# Altium schematic sheet 7 Inch Module.SchDoc: 7" TFT LCD (part 1 of 3)
size A4; SheetSize: A4
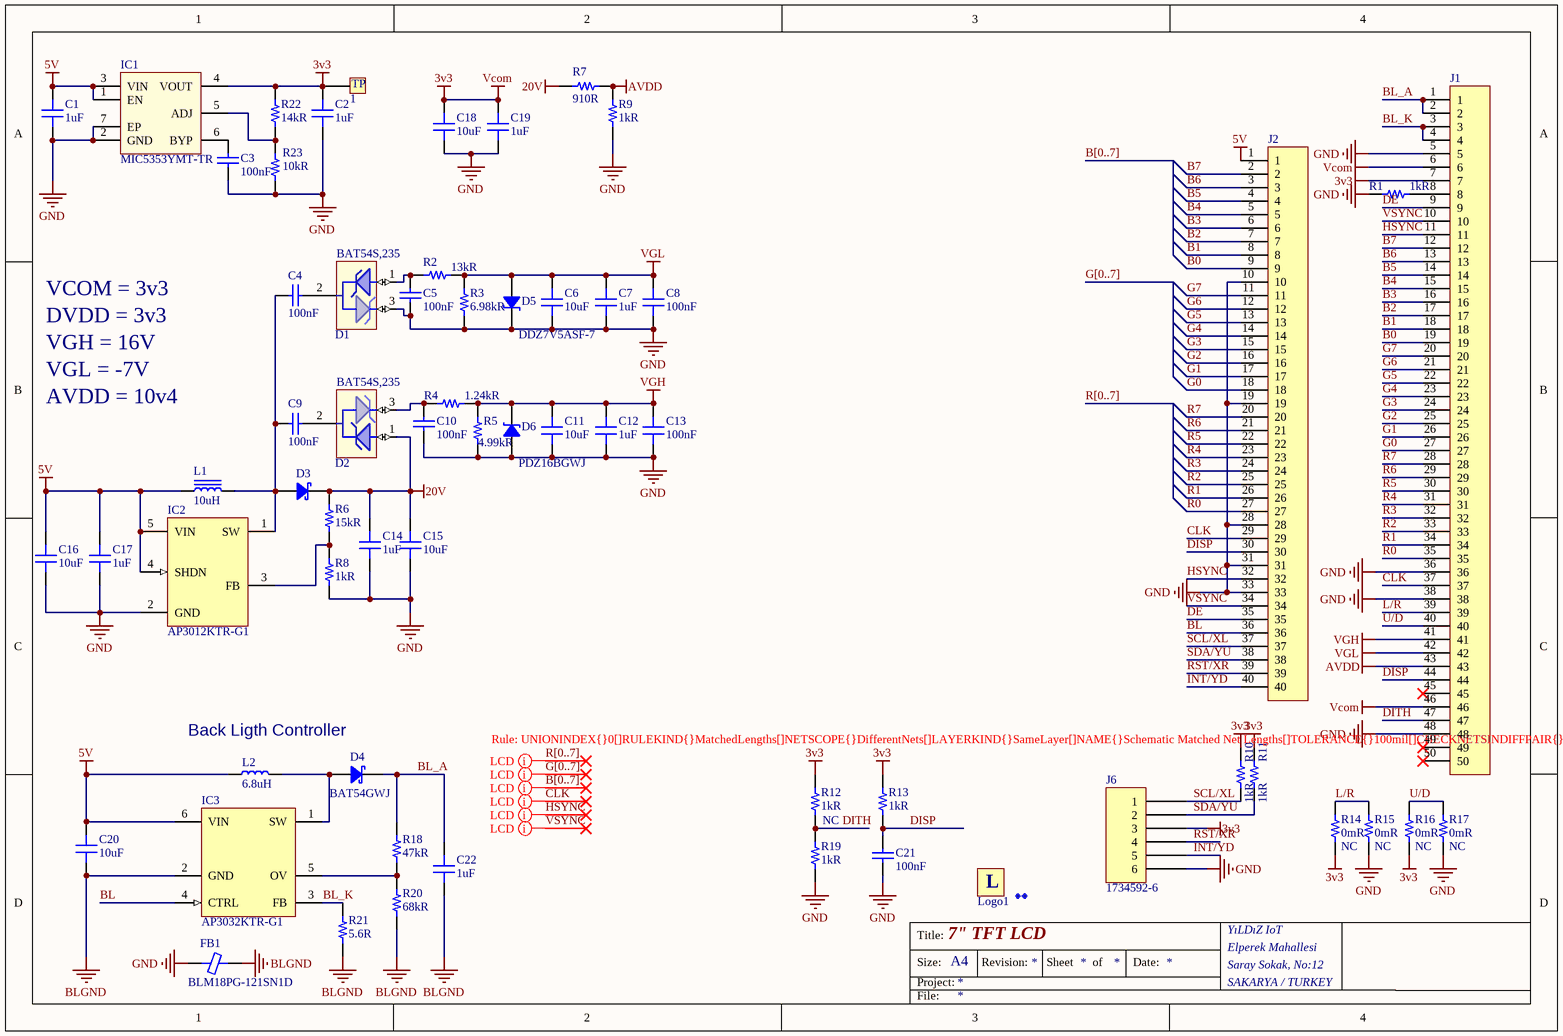
[diagram p0: 7 Inch Module.SchDoc]

## Parts
1  Test Point  [TestPoint]  (value not drawn)  (no BOM)
C1  1uF  [CAP 0603/1608]
C2  1uF  [CAP 0603/1608]
C3  100nF  [CAP 0603/1608]
C4  100nF  [CAP 0603/1608]
C5  100nF  [CAP 0603/1608]
C6  10uF  [CAP 0603/1608]
C7  1uF  [CAP 0603/1608]
C8  100nF  [CAP 0603/1608]
C9  100nF  [CAP 0603/1608]
C10  100nF  [CAP 0603/1608]
C11  10uF  [CAP 0603/1608]
C12  1uF  [CAP 0603/1608]
C13  100nF  [CAP 0603/1608]
C14  1uF  [CAP 0603/1608]
C15  10uF  [CAP 0603/1608]
C16  10uF  [CAP 0603/1608]
C17  1uF  [CAP 0603/1608]
C18  10uF  [CAP 0603/1608]
C19  1uF  [CAP 0603/1608]
C20  10uF  [CAP 0603/1608]
C21  100nF  [CAP 0603/1608]
C22  1uF  [CAP 0603/1608]
D1  BAT54S,235  [DIODES SOT-23-3]
D2  BAT54S,235  [DIODES SOT-23-3]
D3  1N5819HW-7-F  [SOD-123]  (value not drawn)
D4  BAT54GWJ  [SOD-123]
D5  DDZ7V5ASF-7  [SOD323F]
D6  PDZ16BGWJ  [SOD123F]
FB1  BLM18PG-121SN1D  [FER 0603/1608]
Fid1  Fiducial mark  [Fiducial]  (value not drawn)  (no BOM)
Fid2  Fiducial mark  [Fiducial]  (value not drawn)  (no BOM)
IC1  MIC5353YMT-TR  [MICREL MLF-6 1.6x1.6MM]
IC2  AP3012KTR-G1  [DIODES SOT-23-5 W5]
IC3  AP3032KTR-G1  [DIODES SOT-23-6 W6]
J1  62684-501100ALF  [Amphenol 62684-501100ALF]  (value not drawn)
J2  62684-401100ALF  [Amphenol 62684-401100ALF]  (value not drawn)
J6  1734592-6  [FPC-6]
L1  10uH  [TAIYO YUDEN MAMK2520T1R0M]
L2  6.8uH  [FER 0805/2012]
Logo1  Logo symbol  [LOGO_YILDIZIOT]  (value not drawn)  (no BOM)
R1  1kR  [RES 0603/1608]
R2  13kR  [RES 0603/1608]  (no BOM)
R3  6.98kR  [RES 0603/1608]  (no BOM)
R4  1.24kR  [RES 0603/1608]  (no BOM)
R5  4.99kR  [RES 0603/1608]  (no BOM)
R6  15kR  [RES 0603/1608]
R7  910R  [RES 0603/1608]  (no BOM)
R8  1kR  [RES 0603/1608]
R9  1kR  [RES 0603/1608]
R10  1kR  [RES 0603/1608]
R11  1kR  [RES 0603/1608]
R12  1kR  [RES 0603/1608]  (no BOM)
R13  1kR  [RES 0603/1608]
R14  0mR  [RES 0603/1608]  (no BOM)
R15  0mR  [RES 0603/1608]  (no BOM)
R16  0mR  [RES 0603/1608]  (no BOM)
R17  0mR  [RES 0603/1608]  (no BOM)
R18  47kR  [RES 0603/1608]
R19  1kR  [RES 0603/1608]
R20  68kR  [RES 0603/1608]
R21  5.6R  [RES 1206/3216]
R22  14kR  [RES 0603/1608]
R23  10kR  [RES 0603/1608]

## Nets
3v3: 1.1 C2.2 C18.2 C19.2 IC1.4(VOUT) J1.6 J1.7 J1.46 J6.3 R10.1 R11.1 R12.1 R13.2 R14.1 R16.1 R22.2  [also labelled Vcom]
5V: C1.2 C16.2 C17.2 C20.2 IC1.1(EN) IC1.3(VIN) IC2.4(SHDN) IC2.5(VIN) IC3.6(VIN) J2.1 L1.1 L2.1
20V: C14.2 C15.2 D2.1 D3.2 R6.2 R7.1
AVDD: J1.43 R7.2 R9.1
BLGND: C20.1 C22.1 FB1.2 IC3.2(GND) R20.1 R21.1
GND: C1.1 C2.1 C3.1 C5.1 C6.1 C7.1 C8.1 C10.1 C11.1 C12.1 C13.1 C14.1 C15.1 C16.1 C17.1 C18.1 C19.1 C21.1 D1.3 D5.2 D6.1 FB1.1 IC1.2(GND) IC1.7(EP) IC2.2(GND) J1.5 J1.36 J1.38 J1.48 J2.10 J2.19 J2.28 J2.31 J2.33 J6.6 R1.1 R3.1 R5.1 R8.2 R9.2 R15.1 R17.1 R19.2 R23.2
VGH: C11.2 C12.2 C13.2 D6.2 J1.41 R4.2 R5.2
VGL: C6.2 C7.2 C8.2 D5.1 J1.42 R2.2 R3.2
B0: J1.19 J2.9
B1: J1.18 J2.8
B2: J1.17 J2.7
B3: J1.16 J2.6
B4: J1.15 J2.5
B5: J1.14 J2.4
B6: J1.13 J2.3
B7: J1.12 J2.2
BL: IC3.4(CTRL) J2.36
BL_A: C22.2 D4.2 J1.1 J1.2 R18.2
BL_K: IC3.3(FB) J1.3 J1.4 R21.2
CLK: J1.37 J2.29
DE: J1.9 J2.35
DISP: C21.2 J1.44 J2.30 R13.1
DITH: J1.47 R12.2 R19.1
G0: J1.27 J2.18
G1: J1.26 J2.17
G2: J1.25 J2.16
G3: J1.24 J2.15
G4: J1.23 J2.14
G5: J1.22 J2.13
G6: J1.21 J2.12
G7: J1.20 J2.11
HSYNC: J1.11 J2.32
INT/YD: J2.40 J6.5
L/R: J1.39 R14.2 R15.2
R0: J1.35 J2.27
R1: J1.34 J2.26
R2: J1.33 J2.25
R3: J1.32 J2.24
R4: J1.31 J2.23
R5: J1.30 J2.22
R6: J1.29 J2.21
R7: J1.28 J2.20
RST/XR: J2.39 J6.4
SCL/XL: J2.37 J6.1 R10.2
SDA/YU: J2.38 J6.2 R11.2
U/D: J1.40 R16.2 R17.2
VSYNC: J1.10 J2.34
NetC3_2: C3.2 IC1.6(BYP)
NetC4_1: C4.1 D1.2
NetC4_2: C4.2 C9.2 D3.1 IC2.1(SW) L1.2
NetC5_2: C5.2 D1.1 R2.1
NetC9_1: C9.1 D2.2
NetC10_2: C10.2 D2.3 R4.1
NetD4_1: D4.1 IC3.1(SW) L2.2
NetIC1_5: IC1.5(ADJ) R22.1 R23.1
NetIC2_3: IC2.3(FB) R6.1 R8.1
NetIC3_5: IC3.5(OV) R18.1 R20.2
NetJ1_8: J1.8 R1.2

Not connected (* = marked no-connect by the designer): J1 45* 49* 50*

## Buses and harness runs
bus B[0..7]
bus G[0..7]
bus R[0..7]

## Layout directives
rule Matched Net Lengths [Tolerance = 100mil]; net class LCD_R: (no net found under the mark)
rule Matched Net Lengths [Tolerance = 100mil]; net class LCD_G: (no net found under the mark)
rule Matched Net Lengths [Tolerance = 100mil]; net class LCD_B: (no net found under the mark)
rule Matched Net Lengths [Tolerance = 100mil]; net class LCD_CTRL: CLK, HSYNC, VSYNC

## Notes on the sheet
- VCOM = 3v3
- VGH = 16V
- DVDD = 3v3
- VGL = -7V
- AVDD = 10v4
- Back Ligth Controller
- Title:
- Size:
- Project:
- Revision:
- Sheet
- of
- Date:
- YıLDıZ IoT
- Elperek Mahallesi
- Saray Sokak, No:12
- SAKARYA / TURKEY
- File:
- (in symbol Logo) L
- (in symbol Test Point) TP